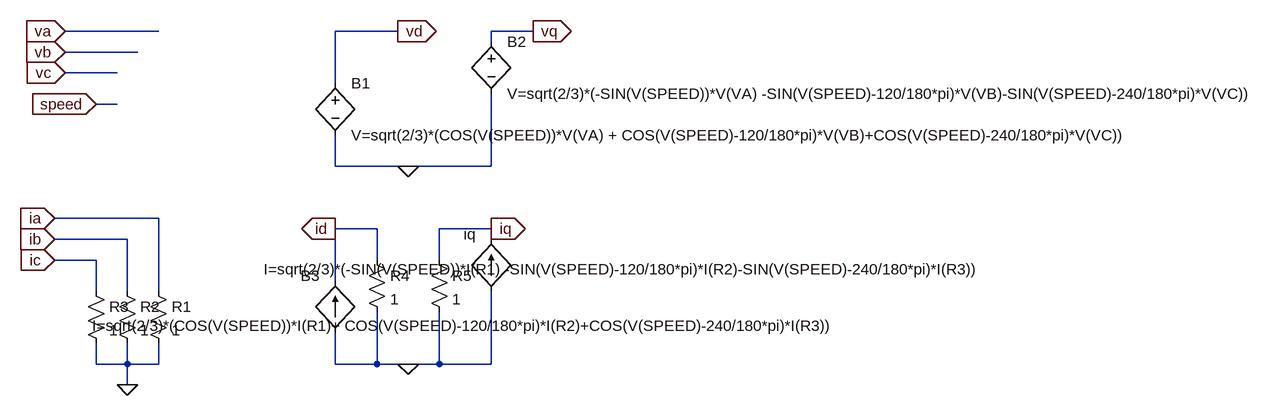
[diagram p0: schematic abc-dq.asc]
abc-dq.asc, the LTspice schematic file:
Version 4
SHEET 1 1560 936
WIRE -272 112 -416 112
WIRE 96 112 0 112
WIRE 304 112 240 112
WIRE 240 128 240 112
WIRE -304 144 -416 144
WIRE -336 176 -416 176
WIRE 0 192 0 112
WIRE -336 224 -368 224
WIRE 0 320 0 272
WIRE 112 320 0 320
WIRE 240 320 240 208
WIRE 240 320 112 320
WIRE -272 400 -432 400
WIRE 64 416 0 416
WIRE 240 416 160 416
WIRE -320 432 -432 432
WIRE 240 432 240 416
WIRE -368 464 -432 464
WIRE 64 464 64 416
WIRE 160 464 160 416
WIRE 0 496 0 416
WIRE -368 512 -368 464
WIRE -320 512 -320 432
WIRE -272 512 -272 400
WIRE -368 624 -368 592
WIRE -320 624 -320 592
WIRE -320 624 -368 624
WIRE -272 624 -272 592
WIRE -272 624 -320 624
WIRE 0 624 0 576
WIRE 64 624 64 544
WIRE 64 624 0 624
WIRE 112 624 64 624
WIRE 160 624 160 544
WIRE 160 624 112 624
WIRE 240 624 240 512
WIRE 240 624 160 624
WIRE -320 656 -320 624
FLAG 96 112 vd
IOPIN 96 112 Out
FLAG 304 112 vq
IOPIN 304 112 Out
FLAG 112 320 0
FLAG -416 112 va
IOPIN -416 112 In
FLAG -416 144 vb
IOPIN -416 144 In
FLAG -416 176 vc
IOPIN -416 176 In
FLAG -368 224 speed
IOPIN -368 224 In
FLAG 0 416 id
IOPIN 0 416 Out
FLAG 240 416 iq
IOPIN 240 416 Out
FLAG 112 624 0
FLAG -432 400 ia
IOPIN -432 400 In
FLAG -432 432 ib
IOPIN -432 432 In
FLAG -432 464 ic
IOPIN -432 464 In
FLAG -320 656 0
SYMBOL bv 0 176 R0
SYMATTR InstName B1
SYMATTR Value V=sqrt(2/3)*(COS(V(SPEED))*V(VA) + COS(V(SPEED)-120/180*pi)*V(VB)+COS(V(SPEED)-240/180*pi)*V(VC))
SYMBOL bv 240 112 R0
SYMATTR InstName B2
SYMATTR Value V=sqrt(2/3)*(-SIN(V(SPEED))*V(VA) -SIN(V(SPEED)-120/180*pi)*V(VB)-SIN(V(SPEED)-240/180*pi)*V(VC))
SYMBOL bi 0 576 R180
WINDOW 0 24 88 Left 0
WINDOW 3 -777 11 Left 0
SYMATTR InstName B3
SYMATTR Value I=sqrt(2/3)*(COS(V(SPEED))*I(R1)+ COS(V(SPEED)-120/180*pi)*I(R2)+COS(V(SPEED)-240/180*pi)*I(R3))
SYMBOL bi 240 512 R180
WINDOW 0 24 88 Left 0
WINDOW 3 -761 34 Left 0
SYMATTR InstName iq
SYMATTR Value I=sqrt(2/3)*(-SIN(V(SPEED))*I(R1) -SIN(V(SPEED)-120/180*pi)*I(R2)-SIN(V(SPEED)-240/180*pi)*I(R3))
SYMBOL res -288 496 R0
SYMATTR InstName R1
SYMATTR Value 1
SYMBOL res -336 496 R0
SYMATTR InstName R2
SYMATTR Value 1
SYMBOL res -384 496 R0
SYMATTR InstName R3
SYMATTR Value 1
SYMBOL res 48 448 R0
SYMATTR InstName R4
SYMATTR Value 1
SYMBOL res 144 448 R0
SYMATTR InstName R5
SYMATTR Value 1

The netlist it stands for:
* abc-dq.asc
B1 vd 0 V=sqrt(2/3)*(COS(V(SPEED))*V(VA) + COS(V(SPEED)-120/180*pi)*V(VB)+COS(V(SPEED)-240/180*pi)*V(VC))
B2 vq 0 V=sqrt(2/3)*(-SIN(V(SPEED))*V(VA) -SIN(V(SPEED)-120/180*pi)*V(VB)-SIN(V(SPEED)-240/180*pi)*V(VC))
B3 0 id I=sqrt(2/3)*(COS(V(SPEED))*I(R1)+ COS(V(SPEED)-120/180*pi)*I(R2)+COS(V(SPEED)-240/180*pi)*I(R3))
B§iq 0 iq I=sqrt(2/3)*(-SIN(V(SPEED))*I(R1) -SIN(V(SPEED)-120/180*pi)*I(R2)-SIN(V(SPEED)-240/180*pi)*I(R3))
R1 ia 0 1
R2 ib 0 1
R3 ic 0 1
R4 id 0 1
R5 iq 0 1
.backanno
.end